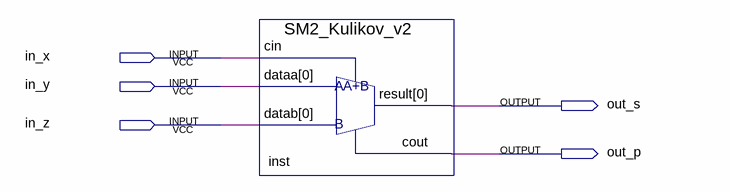
[diagram p0: schematic sheet]
// Quartus schematic Lab2_SM_v2.bdf as structural Verilog: 1 symbols, 5 pins
module Lab2_SM_v2 (
  input  in_x,
  input  in_y,
  input  in_z,
  output out_s,
  output out_p
);

  SM2_Kulikov_v2 inst (.cin(in_x), .dataa(in_y), .datab(in_z), .result(out_s), .cout(out_p));
endmodule
